# Altium project Nexie.PrjPcb
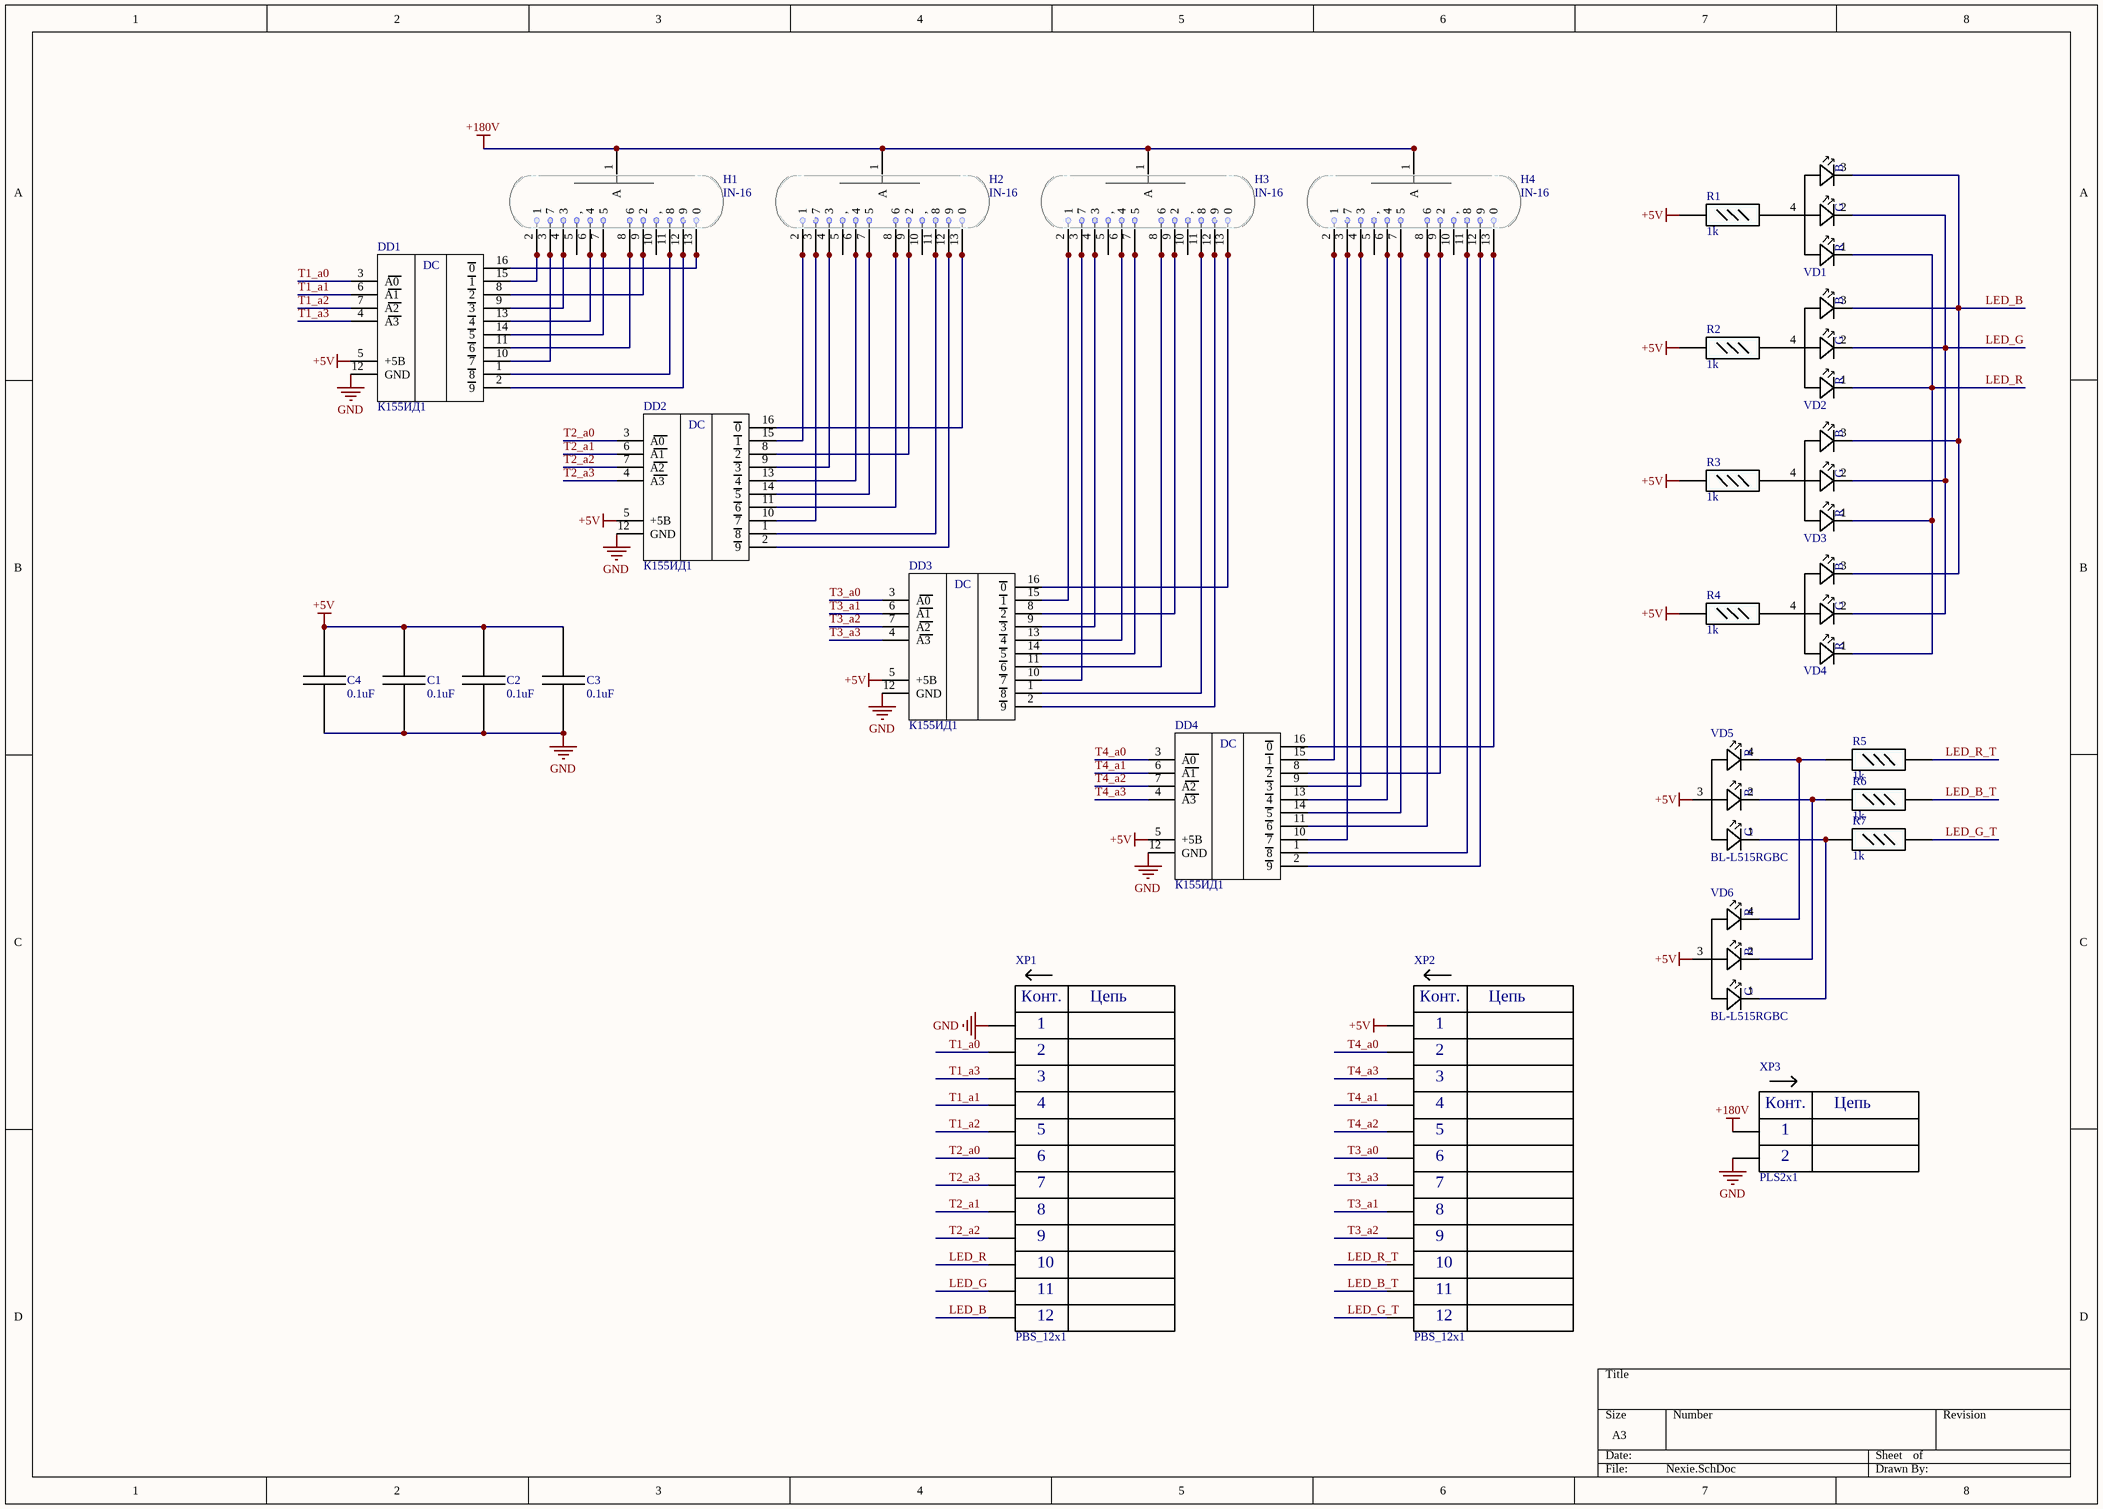
[diagram p0: Nexie.SchDoc]
1 sheet, 28 parts. Net scope: global (net labels, ports and power ports of the same name join across sheets).
Board file: Nexie.PcbDoc

## Sheet Nexie.SchDoc
size A3

### Parts
C1  value 0.1uF  [CAP_1206]  (hidden comment: Cap_0)
C2  value 0.1uF  [CAP_1206]  (hidden comment: Cap_0)
C3  value 0.1uF  [CAP_1206]  (hidden comment: Cap_0)
C4  value 0.1uF  [CAP_1206]  (hidden comment: Cap_0)
DD1  К155ИД1  [К155ИД1]
DD2  К155ИД1  [К155ИД1]
DD3  К155ИД1  [К155ИД1]
DD4  К155ИД1  [К155ИД1]
H1  IN-16  [IN_16_tube]
H2  IN-16  [IN_16_tube]
H3  IN-16  [IN_16_tube]
H4  IN-16  [IN_16_tube]
R1  value 1k  [Resistor_0402]  (hidden comment: Resistors_0.05W)
R2  value 1k  [Resistor_0402]  (hidden comment: Resistors_0.05W)
R3  value 1k  [Resistor_0402]  (hidden comment: Resistors_0.05W)
R4  value 1k  [Resistor_0402]  (hidden comment: Resistors_0.05W)
R5  value 1k  [Resistor_0402]  (hidden comment: Resistors_0.05W)
R6  value 1k  [Resistor_0402]  (hidden comment: Resistors_0.05W)
R7  value 1k  [Resistor_0402]  (hidden comment: Resistors_0.05W)
VD1  TO-3228BC-MRPBFGF  [TO-3228BC-MRPBFGF]  (value not drawn)
VD2  TO-3228BC-MRPBFGF  [TO-3228BC-MRPBFGF]  (value not drawn)
VD3  TO-3228BC-MRPBFGF  [TO-3228BC-MRPBFGF]  (value not drawn)
VD4  TO-3228BC-MRPBFGF  [TO-3228BC-MRPBFGF]  (value not drawn)
VD5  BL-L515RGBC  [BL-L515RGBC]
VD6  BL-L515RGBC  [BL-L515RGBC]
XP1  PBS_12x1  [PBS_12x1]
XP2  PBS_12x1  [PBS_12x1]
XP3  PLS2x1  [PLS2x1]

### Nets
+5V: C1.2 C2.2 C3.2 C4.2 DD1.5(+5В) DD2.5(+5В) DD3.5(+5В) DD4.5(+5В) R1.1 R2.1 R3.1 R4.1 VD5.3 VD6.3 XP2.1
+180V: H1.1(A) H2.1(A) H3.1(A) H4.1(A) XP3.1
GND: C1.1 C2.1 C3.1 C4.1 DD1.12(GND) DD2.12(GND) DD3.12(GND) DD4.12(GND) XP1.1 XP3.2
LED_B: VD1.3(B) VD2.3(B) VD3.3(B) VD4.3(B) XP1.12
LED_B_T: R6.2 XP2.11
LED_G: VD1.2(G) VD2.2(G) VD3.2(G) VD4.2(G) XP1.11
LED_G_T: R7.2 XP2.12
LED_R: VD1.1(R) VD2.1(R) VD3.1(R) VD4.1(R) XP1.10
LED_R_T: R5.2 XP2.10
T1_a0: DD1.3(А0) XP1.2
T1_a1: DD1.6(А1) XP1.4
T1_a2: DD1.7(А2) XP1.5
T1_a3: DD1.4(А3) XP1.3
T2_a0: DD2.3(А0) XP1.6
T2_a1: DD2.6(А1) XP1.8
T2_a2: DD2.7(А2) XP1.9
T2_a3: DD2.4(А3) XP1.7
T3_a0: DD3.3(А0) XP2.6
T3_a1: DD3.6(А1) XP2.8
T3_a2: DD3.7(А2) XP2.9
T3_a3: DD3.4(А3) XP2.7
T4_a0: DD4.3(А0) XP2.2
T4_a1: DD4.6(А1) XP2.4
T4_a2: DD4.7(А2) XP2.5
T4_a3: DD4.4(А3) XP2.3
NetDD1_1: DD1.1(8) H1.11(8)
NetDD1_2: DD1.2(9) H1.12(9)
NetDD1_8: DD1.8(2) H1.9(2)
NetDD1_9: DD1.9(3) H1.4(3)
NetDD1_10: DD1.10(7) H1.3(7)
NetDD1_11: DD1.11(6) H1.8(6)
NetDD1_13: DD1.13(4) H1.6(4)
NetDD1_14: DD1.14(5) H1.7(5)
NetDD1_15: DD1.15(1) H1.2(1)
NetDD1_16: DD1.16(0) H1.13(0)
NetDD2_1: DD2.1(8) H2.11(8)
NetDD2_2: DD2.2(9) H2.12(9)
NetDD2_8: DD2.8(2) H2.9(2)
NetDD2_9: DD2.9(3) H2.4(3)
NetDD2_10: DD2.10(7) H2.3(7)
NetDD2_11: DD2.11(6) H2.8(6)
NetDD2_13: DD2.13(4) H2.6(4)
NetDD2_14: DD2.14(5) H2.7(5)
NetDD2_15: DD2.15(1) H2.2(1)
NetDD2_16: DD2.16(0) H2.13(0)
NetDD3_1: DD3.1(8) H3.11(8)
NetDD3_2: DD3.2(9) H3.12(9)
NetDD3_8: DD3.8(2) H3.9(2)
NetDD3_9: DD3.9(3) H3.4(3)
NetDD3_10: DD3.10(7) H3.3(7)
NetDD3_11: DD3.11(6) H3.8(6)
NetDD3_13: DD3.13(4) H3.6(4)
NetDD3_14: DD3.14(5) H3.7(5)
NetDD3_15: DD3.15(1) H3.2(1)
NetDD3_16: DD3.16(0) H3.13(0)
NetDD4_1: DD4.1(8) H4.11(8)
NetDD4_2: DD4.2(9) H4.12(9)
NetDD4_8: DD4.8(2) H4.9(2)
NetDD4_9: DD4.9(3) H4.4(3)
NetDD4_10: DD4.10(7) H4.3(7)
NetDD4_11: DD4.11(6) H4.8(6)
NetDD4_13: DD4.13(4) H4.6(4)
NetDD4_14: DD4.14(5) H4.7(5)
NetDD4_15: DD4.15(1) H4.2(1)
NetDD4_16: DD4.16(0) H4.13(0)
NetR1_2: R1.2 VD1.4
NetR2_2: R2.2 VD2.4
NetR3_2: R3.2 VD3.4
NetR4_2: R4.2 VD4.4
NetR5_1: R5.1 VD5.4(B) VD6.4(B)
NetR6_1: R6.1 VD5.2(G) VD6.2(G)
NetR7_1: R7.1 VD5.1(R) VD6.1(R)

Not connected (* = marked no-connect by the designer): H1 5(,) 10(,); H2 5(,) 10(,); H3 5(,) 10(,); H4 5(,) 10(,)

### Notes on the sheet
- (in symbol PBS_12x1) Конт.; Цепь
- (in symbol PLS2x1) Конт.; Цепь
- (in symbol К155ИД1) DC